# EAGLE design Airsoft_chronograph (EAGLE 6.5.0)
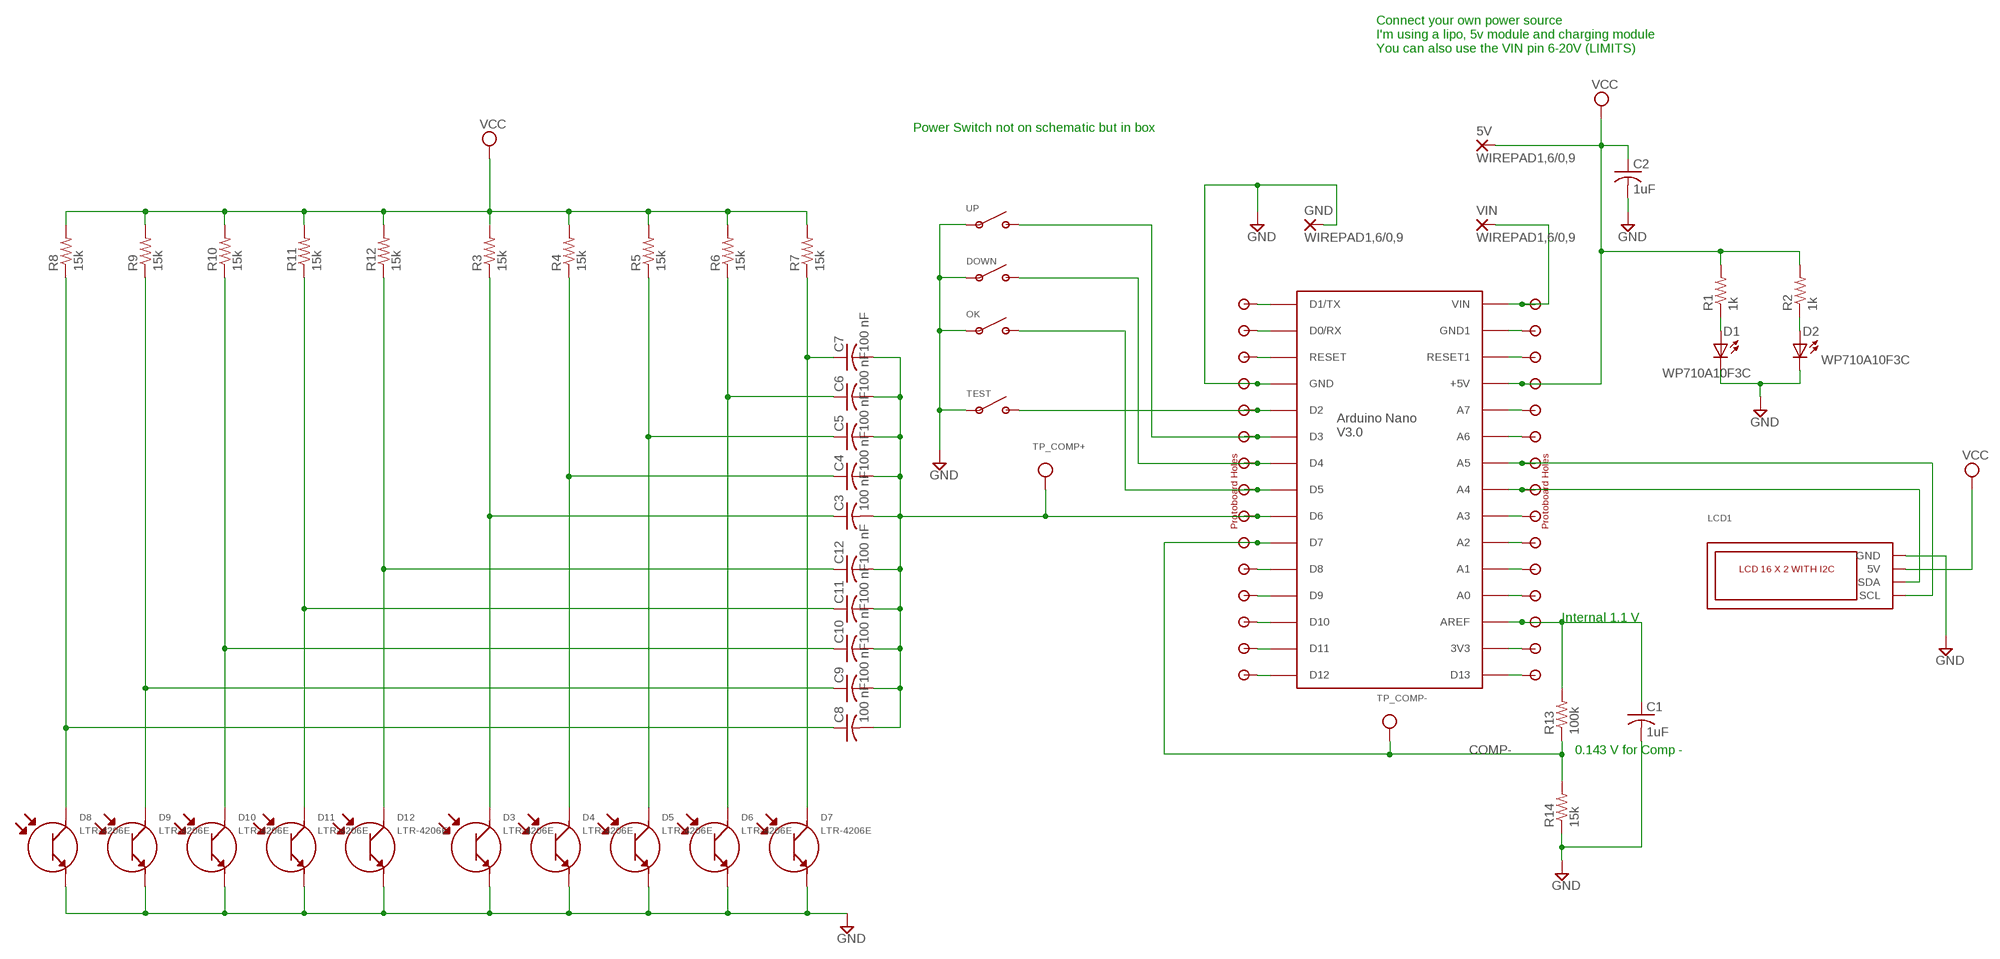
[diagram p0: schematic, sheet 1]

## Parts
5V  WIREPAD1,6/0,9  [1,6/0,9]
C1  1uF  C-USC0805  [C0805]
C2  1uF  C-USC0805  [C0805]
C3  100 nF  C-USC0805  [C0805]
C4  100 nF  C-USC0805  [C0805]
C5  100 nF  C-USC0805  [C0805]
C6  100 nF  C-USC0805  [C0805]
C7  100 nF  C-USC0805  [C0805]
C8  100 nF  C-USC0805  [C0805]
C9  100 nF  C-USC0805  [C0805]
C10  100 nF  C-USC0805  [C0805]
C11  100 nF  C-USC0805  [C0805]
C12  100 nF  C-USC0805  [C0805]
D1  WP710A10F3C  [3MMLED]
D2  WP710A10F3C  [3MMLED]
D3  LTR-4206E  [3MMLED]
D4  LTR-4206E  [3MMLED]
D5  LTR-4206E  [3MMLED]
D6  LTR-4206E  [3MMLED]
D7  LTR-4206E  [3MMLED]
D8  LTR-4206E  [3MMLED]
D9  LTR-4206E  [3MMLED]
D10  LTR-4206E  [3MMLED]
D11  LTR-4206E  [3MMLED]
D12  LTR-4206E  [3MMLED]
DOWN  SW_SPST  [2WIRES]
GND  WIREPAD1,6/0,9  [1,6/0,9]
LCD1  LCD_16X2_I2C  [LCD_I2C]
OK  SW_SPST  [2WIRES]
R1  1k  R-US_M0805  [M0805]
R2  1k  R-US_M0805  [M0805]
R3  15k  R-US_M0805  [M0805]
R4  15k  R-US_M0805  [M0805]
R5  15k  R-US_M0805  [M0805]
R6  15k  R-US_M0805  [M0805]
R7  15k  R-US_M0805  [M0805]
R8  15k  R-US_M0805  [M0805]
R9  15k  R-US_M0805  [M0805]
R10  15k  R-US_M0805  [M0805]
R11  15k  R-US_M0805  [M0805]
R12  15k  R-US_M0805  [M0805]
R13  100k  R-US_M0805  [M0805]
R14  15k  R-US_M0805  [M0805]
TEST  SW_SPST  [2WIRES]
TP_COMP+  TESTPOINT0.1"  [1X01_ROUND]
TP_COMP-  TESTPOINT0.1"  [1X01_ROUND]
U$1  Arduino Nano V3  ARDUINONANO  [PDIP-32]
U$2  1X15_PROTO  [1X15_PROTO]
U$3  1X15_PROTO  [1X15_PROTO]
UP  SW_SPST  [2WIRES]
VIN  WIREPAD1,6/0,9  [1,6/0,9]

## Nets
COMP-: R13.1 R14.2 TP_COMP-.1 U$1.D7 U$2.10
GND [power]: C1.2 C2.2 D1.K D2.K D3.A(EMITTER+) D4.A(EMITTER+) D5.A(EMITTER+) D6.A(EMITTER+) D7.A(EMITTER+) D8.A(EMITTER+) D9.A(EMITTER+) D10.A(EMITTER+) D11.A(EMITTER+) D12.A(EMITTER+) DOWN.P$1(A) GND.1(P) LCD1.GND OK.P$1(A) R14.1 TEST.P$1(A) U$1.GND U$2.4 UP.P$1(A)
N$1: D1.A R1.1
N$2: D2.A R2.1
N$3: C3.1 D3.K(COLLECTOR-) R3.1
N$4: C4.1 D4.K(COLLECTOR-) R4.1
N$5: C5.1 D5.K(COLLECTOR-) R5.1
N$6: C6.1 D6.K(COLLECTOR-) R6.1
N$7: C7.1 D7.K(COLLECTOR-) R7.1
N$8: C8.1 D8.K(COLLECTOR-) R8.1
N$9: C9.1 D9.K(COLLECTOR-) R9.1
N$10: C10.1 D10.K(COLLECTOR-) R10.1
N$11: C11.1 D11.K(COLLECTOR-) R11.1
N$12: C12.1 D12.K(COLLECTOR-) R12.1
N$13: C3.2 C4.2 C5.2 C6.2 C7.2 C8.2 C9.2 C10.2 C11.2 C12.2 TP_COMP+.1 U$1.D6 U$2.9
N$14: U$1.D3 U$2.6 UP.P$2(B)
N$15: DOWN.P$2(B) U$1.D4 U$2.7
N$16: OK.P$2(B) U$1.D5 U$2.8
N$17: TEST.P$2(B) U$1.D2 U$2.5
N$18: LCD1.SDA U$1.A4 U$3.8
N$19: LCD1.SCL U$1.A5 U$3.7
N$20: U$1.D1/TX U$2.1
N$21: C1.1 R13.2 U$1.AREF U$3.13
N$22: U$1.D0/RX U$2.2
N$23 [power]: U$1.VIN U$3.1 VIN.1(P)
N$24: U$1.RESET U$2.3
N$25: U$1.D8 U$2.11
N$26: U$1.D9 U$2.12
N$27: U$1.D10 U$2.13
N$28: U$1.D11 U$2.14
N$29: U$1.D12 U$2.15
N$30: U$1.GND1 U$3.2
N$31: U$1.RESET1 U$3.3
N$32: U$1.A7 U$3.5
N$33: U$1.A6 U$3.6
N$34: U$1.A3 U$3.9
N$35: U$1.A2 U$3.10
N$36: U$1.A1 U$3.11
N$37: U$1.A0 U$3.12
N$38: U$1.3V3 U$3.14
N$39: U$1.D13 U$3.15
VCC [power]: 5V.1(P) C2.1 LCD1.5V R1.2 R2.2 R3.2 R4.2 R5.2 R6.2 R7.2 R8.2 R9.2 R10.2 R11.2 R12.2 U$1.+5V U$3.4

## Notes on the sheet
- Connect your own power source
  I'm using a lipo, 5v module and charging module
  You can also use the VIN pin 6-20V (LIMITS)
- Power Switch not on schematic but in box
- Internal 1.1 V
- 0.143 V for Comp -

## Library data of the parts
5V GND VIN = wirepad:WIREPAD: Wire PAD connect wire on PCB
C1-C12 = rcl:C-US: CAPACITOR, American symbol
D1 D2 = Albert:WP710A10F3C: WP710A10F3C 3MM IR Transmitter
D3-D12 = Albert:LTR-4206E: LTR-4206E NPN PHOTOTRANSISTOR IR receiver
DOWN OK TEST UP = Albert:SW_SPST
LCD1 = Albert:LCD_16X2_I2C: LCD 16 X 2 Characters I2C
R1-R14 = rcl:R-US_: RESISTOR, American symbol
TP_COMP+ TP_COMP- = microbuilder:TESTPOINT: Test Point Various test points for characterisation and PCB testing TESTPOINT_SMT - Compact Surface Mount Test Point [Digikey: 5016KTR-ND]; BOM: EXCLUDE
U$1 = rocketfarm:ARDUINONANO
U$2 U$3 = Albert:1X15_PROTO: 1x15 Protoboard holes

## Net classes
0 default: width 0.305 mm, drill 0.33 mm, clearance 0.203 mm
1 power: width 0.406 mm, drill 0.33 mm, clearance 0.203 mm

## Board
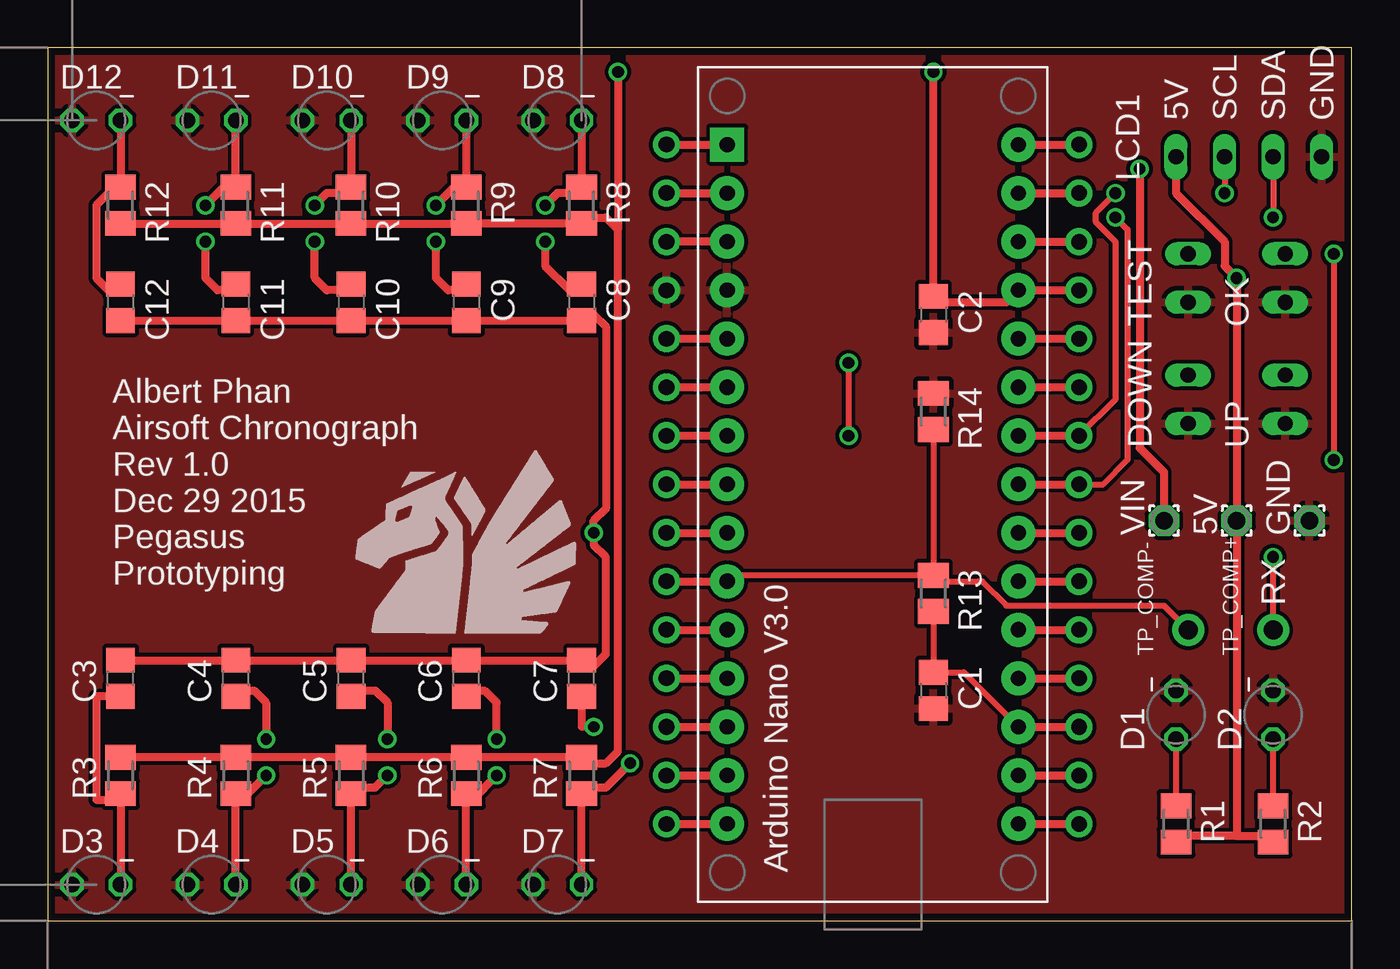
[diagram p1: board, top side]
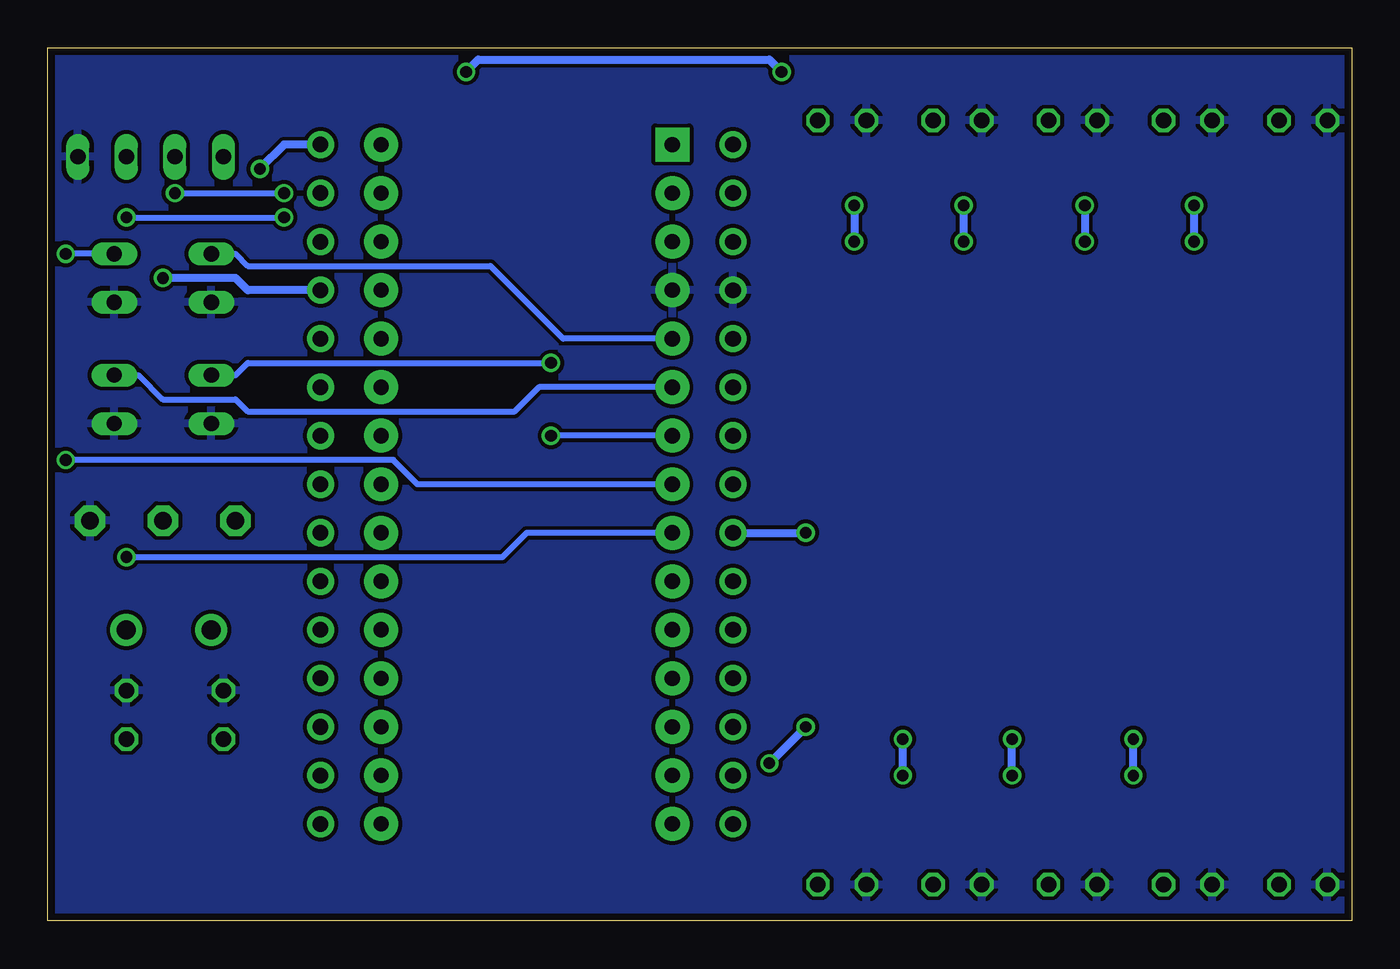
[diagram p2: board, bottom side, seen from below]

Size 68.25 x 45.71 mm. Coordinates in mm from the lower left corner, seen from the top.
Outline: 0,0 68.25,0 68.25,45.71 0,45.71 0,0
Copper layers (1*16): Top 0.0356mm / dielectric 1.5011mm / Bottom 0.0356mm
Design rules "OSHPARKPCBOrder": minimum track width 6mil, minimum drill 13mil, track to track 6mil, track to pad 6mil, pad to pad 6mil, via to via 6mil, smd to smd 6mil, copper to edge 15mil, drill to drill 6mil, minimum pad ring 7mil, minimum via ring 7mil, stop-mask expansion 3mil, vias tented up to drill 0mil, thermal gap 10mil

### Footprints (pad centres in the part's own frame; a part is rotated, then mirrored left to right if it is on the bottom)
1,6/0,9 = drill 0.914 pad 1.6 octagon: 1 0,0
C0805 = smd 1.3 x 1.5: 1 -0.95,0; 2 0.95,0
3MMLED = drill 0.813 octagon: A -1.27,0; K 1.27,0
2WIRES = drill 0.8 long: P$1 0,0; P$2 2.54,0
LCD_I2C = drill 0.8 long: 5V 0,0; GND 7.62,0; SCL 2.54,0; SDA 5.08,0
M0805 = smd 1.3 x 1.6: 1 -0.95,0; 2 0.95,0
1X01_ROUND = drill 1 pad 1.676: 1 0,0
PDIP-32 = drill 0.8 pad 1.778: 3V3 15.24,-35.56; +5V 15.24,-10.16; A0 15.24,-30.48; A1 15.24,-27.94; A2 15.24,-25.4; A3 15.24,-22.86; A4 15.24,-20.32; A5 15.24,-17.78; A6 15.24,-15.24; A7 15.24,-12.7; AREF 15.24,-33.02; D0/RX 0,-5.08; D2 0,-12.7; D3 0,-15.24; D4 0,-17.78; D5 0,-20.32; D6 0,-22.86; D7 0,-25.4; D8 0,-27.94; D9 0,-30.48; D10 0,-33.02; D11 0,-35.56; D12 0,-38.1; D13 15.24,-38.1; GND 0,-10.16; GND1 15.24,-5.08; RESET 0,-7.62; RESET1 15.24,-7.62; VIN 15.24,-2.54 | drill 0.8 pad 1.778 square: D1/TX 0,-2.54
1X15_PROTO = drill 0.813 pad 1.422: 1 0,0; 2 0,-2.54; 3 0,-5.08; 4 0,-7.62; 5 0,-10.16; 6 0,-12.7; 7 0,-15.24; 8 0,-17.78; 9 0,-20.32; 10 0,-22.86; 11 0,-25.4; 12 0,-27.94; 13 0,-30.48; 14 0,-33.02; 15 0,-35.56

### Placement (x,y rotation side)
5V  62.23,20.95 90 top
C1  46.35,12.06 270 top
C2  46.35,31.75 270 top
C3  3.81,12.7 90 top
C4  9.84,12.7 90 top
C5  15.88,12.7 90 top
C6  21.91,12.7 90 top
C7  27.94,12.7 90 top
C8  27.94,32.38 270 top
C9  21.91,32.38 270 top
C10  15.88,32.38 270 top
C11  9.84,32.38 270 top
C12  3.81,32.38 270 top
D1  59.05,10.79 90 top
D2  64.14,10.79 90 top
D3  2.54,1.91 0 top
D4  8.57,1.91 0 top
D5  14.61,1.91 0 top
D6  20.64,1.91 0 top
D7  26.67,1.91 0 top
D8  26.67,41.91 0 top
D9  20.64,41.91 0 top
D10  14.61,41.91 0 top
D11  8.57,41.91 0 top
D12  2.54,41.91 0 top
DOWN  59.69,26.04 90 top
GND  66.04,20.95 90 top
LCD1  59.05,40.01 0 top
OK  64.77,32.38 90 top
R1  59.05,5.08 270 top
R2  64.14,5.08 270 top
R3  3.81,7.62 90 top
R4  9.84,7.62 90 top
R5  15.88,7.62 90 top
R6  21.91,7.62 90 top
R7  27.94,7.62 90 top
R8  27.94,37.47 270 top
R9  21.91,37.47 270 top
R10  15.88,37.47 270 top
R11  9.84,37.47 270 top
R12  3.81,37.47 270 top
R13  46.35,17.14 270 top
R14  46.35,26.67 270 top
TEST  59.69,32.38 90 top
TP_COMP+  64.14,15.24 90 top
TP_COMP-  59.69,15.24 90 top
U$1  35.56,43.18 0 top
U$2  32.38,40.64 0 top
U$3  53.98,40.64 0 top
UP  64.77,26.04 90 top
VIN  58.42,20.95 90 top

### Tracks (layer width: path | path; a pad name or v marks a point on that pad's centre or on a via)
COMP-
  Top 0.305: R14.2 R13.1 | R13.1 46.35,17.78 48.9,17.78 50.16,16.51 58.42,16.51 TP_COMP-.1 | R13.1 35.88,18.09 U$1.D7
  Top 0.406: U$2.10 U$1.D7
GND
  pour Top: 0,45.72 68.58,45.72 68.58,0 0,0
  pour Bottom: 0,45.72 68.58,45.72 68.58,0 0,0
N$1
  Top 0.305: D1.A R1.1
N$2
  Top 0.305: R2.1 D2.A
N$3
  Top 0.406: D3.K R3.1 3.81,6.35 2.54,6.35 2.54,11.75 C3.1
N$4  (via drill 0.6)
  Top 0.406: D4.K R4.1 10.16,6.35 v11.43,7.62 | v11.43,9.53 11.43,11.43 10.79,12.06 10.16,12.06 C4.1
  Bottom 0.406: v11.43,7.62 v11.43,9.53
N$5  (via drill 0.6)
  Top 0.406: D5.K R5.1 15.88,6.99 17.14,6.99 v17.78,7.62 | v17.78,9.53 17.78,11.43 17.14,12.06 15.88,12.06 C5.1
  Bottom 0.406: v17.78,7.62 v17.78,9.53
N$6  (via drill 0.6)
  Top 0.406: D6.K R6.1 22.23,6.35 v23.5,7.62 | C6.1 22.23,12.06 22.86,12.06 23.5,11.43 v23.5,9.53
  Bottom 0.406: v23.5,7.62 v23.5,9.53
N$7  (via drill 0.6)
  Top 0.406: D7.K R7.1 27.94,6.99 29.21,6.99 v30.48,8.26 | C7.1 27.94,10.16 v28.57,10.16
  Bottom 0.406: v30.48,8.26 v28.57,10.16
N$8  (via drill 0.61)
  Top 0.406: D8.K R8.1 27.94,38.1 26.67,38.1 v26.04,37.47 | C8.1 27.94,33.02 27.3,33.02 26.04,34.29 v26.04,35.56
  Bottom 0.406: v26.04,37.47 v26.04,35.56
N$9  (via drill 0.61)
  Top 0.406: D9.K R9.1 21.59,38.73 v20.32,37.47 | v20.32,35.56 20.32,33.66 20.95,33.02 21.59,33.02 C9.1
  Bottom 0.406: v20.32,37.47 v20.32,35.56
N$10  (via drill 0.61)
  Top 0.406: D10.K R10.1 15.88,38.1 14.61,38.1 v13.97,37.47 | v13.97,35.56 13.97,33.66 14.61,33.02 15.88,33.02 C10.1
  Bottom 0.406: v13.97,37.47 v13.97,35.56
N$11  (via drill 0.61)
  Top 0.406: D11.K R11.1 9.53,38.73 v8.26,37.47 | v8.26,35.56 8.26,33.66 8.89,33.02 9.53,33.02 C11.1
  Bottom 0.406: v8.26,37.47 v8.26,35.56
N$12
  Top 0.406: D12.K 3.81,38.73 | C12.1 3.81,33.02 3.17,33.02 2.54,33.66 2.54,37.47 3.81,38.73 | 3.81,38.73 R12.1
N$13  (via drill 0.61)
  Top 0.305: TP_COMP+.1 v64.14,19.05
  Top 0.406: C12.2 C11.2 C10.2 C9.2 C8.2 27.94,31.75 28.57,31.75 29.21,31.11 29.21,21.59 28.57,20.95 v28.57,20.32 28.57,19.68 29.21,19.05 29.21,13.97 28.57,13.34 27.94,13.34 C7.2 C6.2 C5.2 C4.2 C3.2 | U$2.9 U$1.D6
  Bottom 0.305: U$1.D6 43.18,20.32 44.45,19.05 v64.14,19.05
  Bottom 0.406: U$2.9 v28.57,20.32
N$14
  Top 0.406: U$2.6 U$1.D3
  Bottom 0.305: U$1.D3 42.55,27.94 43.81,26.67 57.78,26.67 58.42,27.3 62.23,27.3 63.5,28.57 UP.P$2
N$15  (via drill 0.61)
  Top 0.305: v41.91,29.21 v41.91,25.4
  Top 0.406: U$2.7 U$1.D4
  Bottom 0.305: U$1.D4 v41.91,25.4 | v41.91,29.21 57.78,29.21 58.42,28.57 DOWN.P$2
N$16  (via drill 0.61)
  Top 0.305: v67.31,34.92 v67.31,24.13
  Top 0.406: U$2.8 U$1.D5
  Bottom 0.305: OK.P$2 v67.31,34.92 | v67.31,24.13 50.16,24.13 48.9,22.86 U$1.D5
N$17
  Top 0.406: U$2.5 U$1.D2
  Bottom 0.305: U$1.D2 41.27,30.48 45.09,34.29 57.78,34.29 58.42,34.92 TEST.P$2
N$18  (via drill 0.61)
  Top 0.305: v55.88,36.83 56.52,36.2 56.52,24.13 55.24,22.86 U$3.8 | LCD1.SDA v64.14,36.83
  Top 0.406: U$1.A4 U$3.8
  Bottom 0.305: v64.14,36.83 v55.88,36.83
N$19  (via drill 0.61)
  Top 0.305: U$3.7 55.88,27.3 55.88,35.56 54.86,36.58 54.86,37.08 v55.88,38.1 | LCD1.SCL v61.59,38.1
  Top 0.406: U$1.A5 U$3.7
  Bottom 0.305: v61.59,38.1 v55.88,38.1
N$20
  Top 0.406: U$2.1 U$1.D1/TX
N$21
  Top 0.305: R13.2 C1.1 47.95,13.02 U$1.AREF
  Top 0.406: U$1.AREF U$3.13
N$22
  Top 0.406: U$2.2 U$1.D0/RX
N$23  (via drill 0.61)
  Top 0.406: U$1.VIN U$3.1 | VIN.1 58.42,23.5 57.15,24.77 v57.15,39.37
  Bottom 0.406: v57.15,39.37 55.88,40.64 U$3.1
N$24
  Top 0.406: U$1.RESET U$2.3
N$25
  Top 0.406: U$2.11 U$1.D8
N$26
  Top 0.406: U$2.12 U$1.D9
N$27
  Top 0.406: U$2.13 U$1.D10
N$28
  Top 0.406: U$2.14 U$1.D11
N$29
  Top 0.406: U$2.15 U$1.D12
N$30
  Top 0.406: U$1.GND1 U$3.2
N$31
  Top 0.406: U$1.RESET1 U$3.3
N$32
  Top 0.406: U$1.A7 U$3.5
N$33
  Top 0.406: U$1.A6 U$3.6
N$34
  Top 0.406: U$1.A3 U$3.9
N$35
  Top 0.406: U$1.A2 U$3.10
N$36
  Top 0.406: U$1.A1 U$3.11
N$37
  Top 0.406: U$1.A0 U$3.12
N$38
  Top 0.406: U$1.3V3 U$3.14
N$39
  Top 0.406: U$1.D13 U$3.15
VCC  (via drill 0.61)
  Top 0.406: R12.2 R11.2 R10.2 R9.2 R8.2 27.94,36.83 29.21,36.83 29.84,36.2 | R3.2 R4.2 R5.2 R6.2 R7.2 27.94,8.26 29.21,8.26 29.84,8.89 29.84,36.2 | U$3.4 U$1.+5V 50.16,32.38 46.35,32.38 C2.1 v46.35,44.45 | LCD1.5V 59.05,38.1 61.59,35.56 61.59,34.29 v62.23,33.66 5V.1 62.23,4.45 | v29.84,44.45 29.84,36.2 | 62.23,4.45 59.05,4.45 R1.2 | 62.23,4.45 64.14,4.45 R2.2
  Bottom 0.406: v62.23,33.66 58.42,33.66 57.78,33.02 U$3.4 | v29.84,44.45 30.48,45.09 45.72,45.09 v46.35,44.45

### Text on the board
tPlace: Albert Phan / Airsoft Chronograph / Rev 1.0 / Dec 29 2015 / Pegasus / Prototyping | RX | Arduino Nano V3.0